# EAGLE design l-band-frontend (EAGLE 9.1.3)
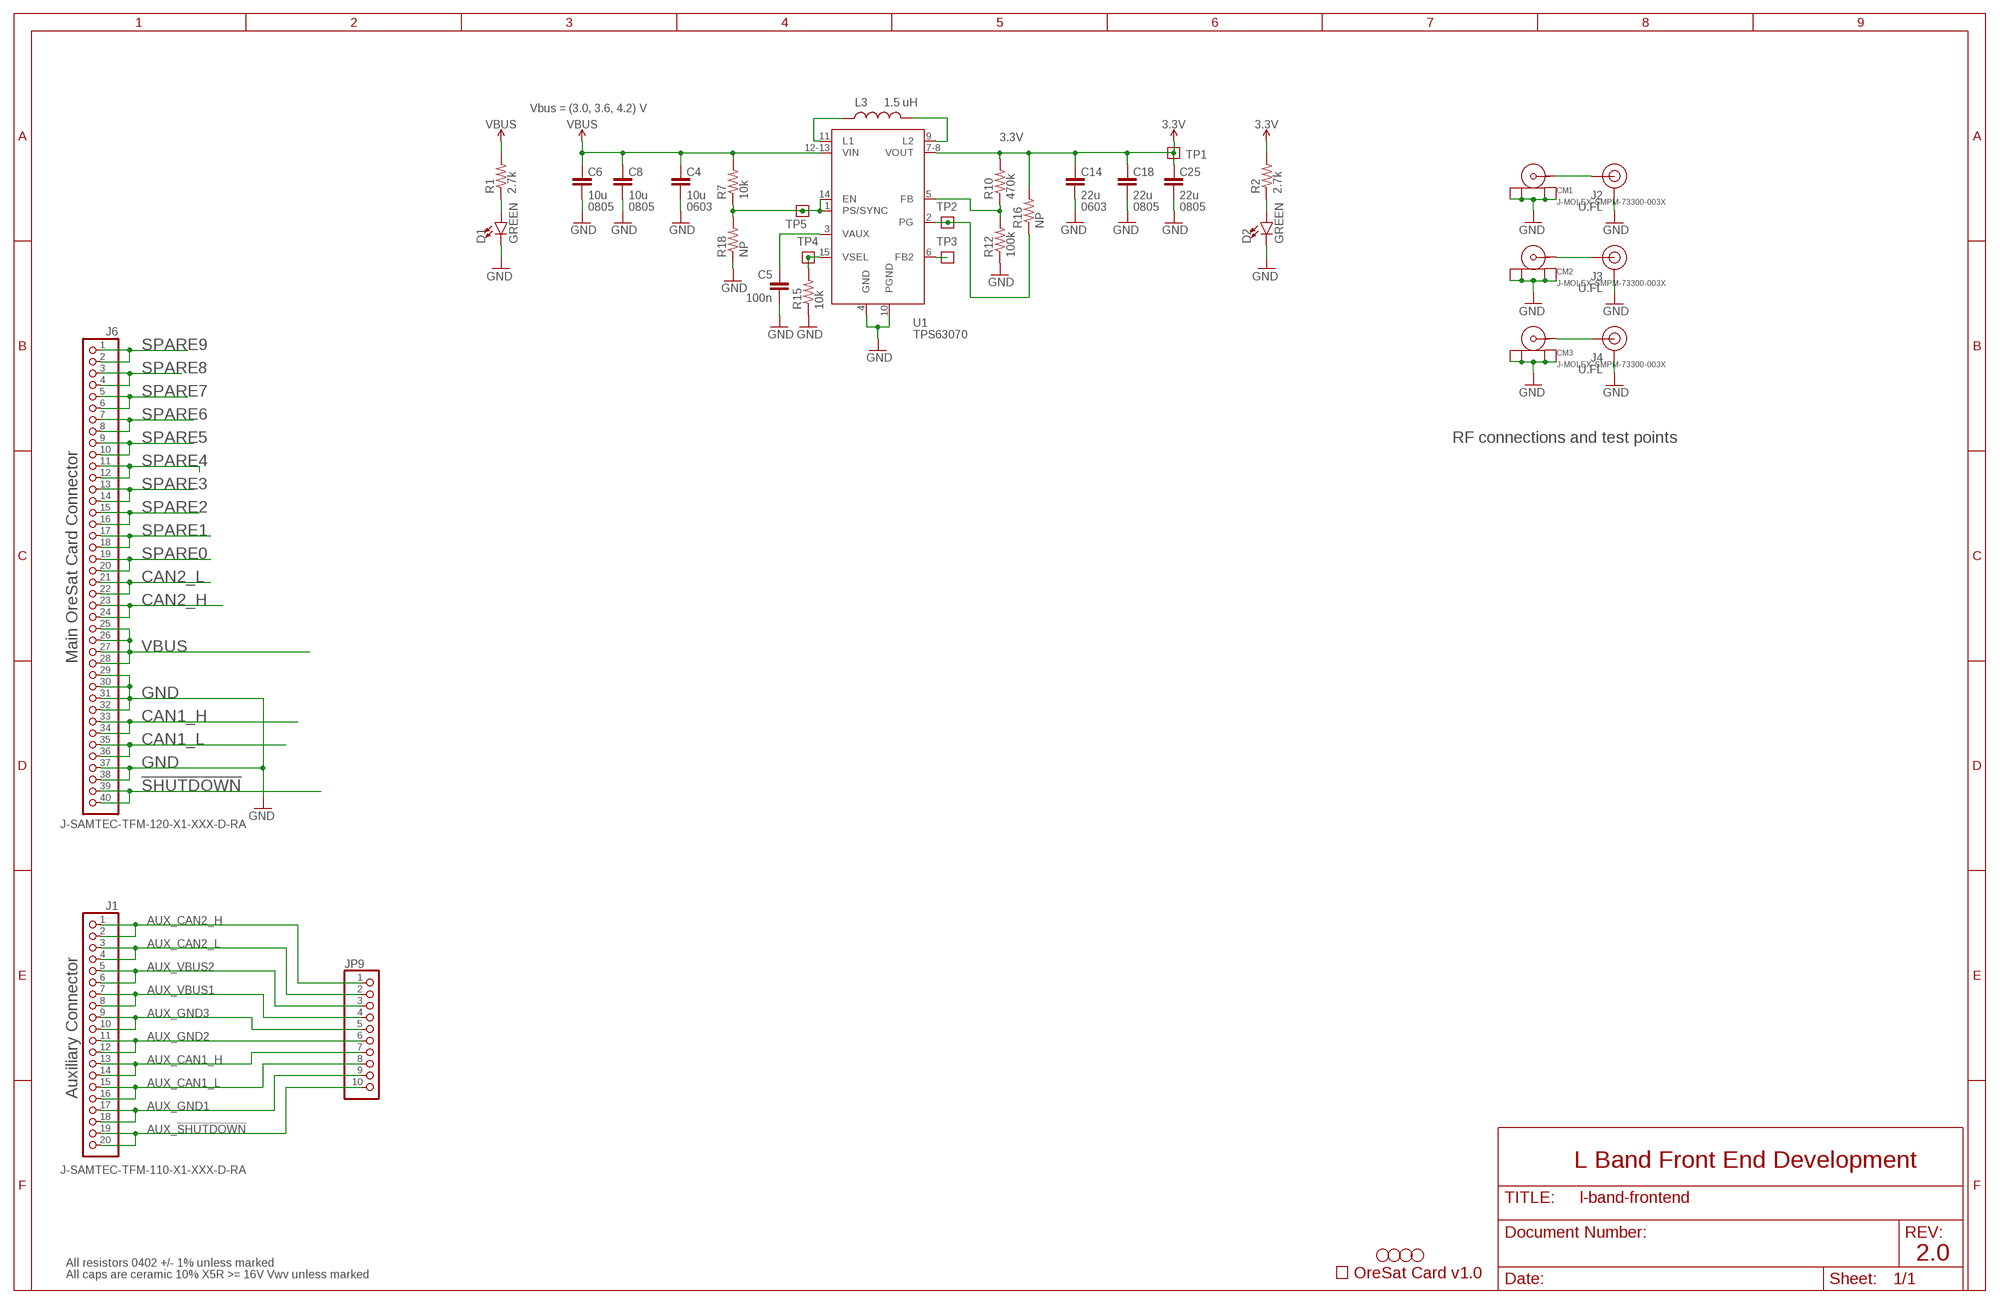
[diagram p0: schematic, sheet 1]

## Parts
C4  10u  C-EU0603-B-NOSILK  [.0603-B-NOSILK]
C5  100n  C-EU0402-B-NOSILK  [.0402-B-NOSILK]
C6  10u  C-EU0805-B-NOSILK  [.0805-B-NOSILK]
C8  10u  C-EU0805-B-NOSILK  [.0805-B-NOSILK]
C14  22u  C-EU0603-B-NOSILK  [.0603-B-NOSILK]
C18  22u  C-EU0805-B-NOSILK  [.0805-B-NOSILK]
C25  22u  C-EU0805-B-NOSILK  [.0805-B-NOSILK]
CARD  ORESAT-CARD-V0.5  [ORESAT-CARD-V1.0]
CM1  J-MOLEX-SMPM-73300-003X  [J-MOLEX-SMPM-073300-003X]
CM2  J-MOLEX-SMPM-73300-003X  [J-MOLEX-SMPM-073300-003X]
CM3  J-MOLEX-SMPM-73300-003X  [J-MOLEX-SMPM-073300-003X]
D1  GREEN  LED-GREEN0603  [LED-0603]
D2  GREEN  LED-GREEN0603  [LED-0603]
H1  STAND-OFFTIGHT  [STAND-OFF-TIGHT]
H2  STAND-OFFTIGHT  [STAND-OFF-TIGHT]
H3  STAND-OFFTIGHT  [STAND-OFF-TIGHT]
H4  STAND-OFFTIGHT  [STAND-OFF-TIGHT]
J1  J-SAMTEC-TFM-110-X1-XXX-D-RA  [J-SAMTEC-TFM-110-X1-XXX-D-RA]
J2  U.FL  U.FL2PIN  [U.FL]
J3  U.FL  U.FL2PIN  [U.FL]
J4  U.FL  U.FL2PIN  [U.FL]
J6  J-SAMTEC-TFM-120-X1-XXX-D-RA  [J-SAMTEC-TFM-120-X1-XXX-D-RA]
JP9  PINHD-1X10  [1X10]
L3  1.5 uH  L-COILCRAFT-XFL4020  [L-COILCRAFT-XFL4020]
R1  2.7k  R-US_0402-B-NOSILK  [.0402-B-NOSILK]
R2  2.7k  R-US_0402-B-NOSILK  [.0402-B-NOSILK]
R7  10k  R-US_0402-B-NOSILK  [.0402-B-NOSILK]
R10  470k  R-US_0402-B-NOSILK  [.0402-B-NOSILK]
R12  100k  R-US_0402-B-NOSILK  [.0402-B-NOSILK]
R15  10k  R-US_0402-B-NOSILK  [.0402-B-NOSILK]
R16  NP  R-US_0402-B-NOSILK  [.0402-B-NOSILK]
R18  NP  R-US_0402-B-NOSILK  [.0402-B-NOSILK]
TP1  TEST-POINT  [2MM-TEST-POINT]
TP2  TEST-POINT  [2MM-TEST-POINT]
TP3  TEST-POINT  [2MM-TEST-POINT]
TP4  TEST-POINT  [2MM-TEST-POINT]
TP5  TEST-POINT  [2MM-TEST-POINT]
U1  TPS63070  TPS63070X  [TPS63070X]

## Nets
3.3V: C14.1 C18.1 C25.1 R2.2 R10.2 R16.2 TP1.1 U1.7-8(VOUT)
!SHUTDOWN: J6.39 J6.40
AUX_!SHUTDOWN: J1.19 J1.20 JP9.10
AUX_CAN1_H: J1.13 J1.14 JP9.7
AUX_CAN1_L: J1.15 J1.16 JP9.8
AUX_CAN2_H: J1.1 J1.2 JP9.1
AUX_CAN2_L: J1.3 J1.4 JP9.2
AUX_GND1: J1.17 J1.18 JP9.9
AUX_GND2: J1.11 J1.12 JP9.6
AUX_GND3: J1.9 J1.10 JP9.5
AUX_VBUS1: J1.7 J1.8 JP9.4
AUX_VBUS2: J1.5 J1.6 JP9.3
CAN1_H: J6.33 J6.34
CAN1_L: J6.35 J6.36
CAN2_H: J6.23 J6.24
CAN2_L: J6.21 J6.22
GND: C4.2 C5.2 C6.2 C8.2 C14.2 C18.2 C25.2 CM1.P$1(SHIELD3) CM1.P$2(SHIELD2) CM1.P$3(SHIELD1) CM1.P$4(SHIELD) CM2.P$1(SHIELD3) CM2.P$2(SHIELD2) CM2.P$3(SHIELD1) CM2.P$4(SHIELD) CM3.P$1(SHIELD3) CM3.P$2(SHIELD2) CM3.P$3(SHIELD1) CM3.P$4(SHIELD) D1.C D2.C J2.1(GND) J2.2(GND) J3.1(GND) J3.2(GND) J4.1(GND) J4.2(GND) J6.29 J6.30 J6.31 J6.32 J6.37 J6.38 R12.1 R15.1 R18.1 U1.4(GND) U1.10(PGND)
N$270: D1.A R1.1
N$271: D2.A R2.1
N$300: CM3.RF(CENTER) J4.FEED(SIGNAL)
RF1: CM1.RF(CENTER) J2.FEED(SIGNAL)
RF2: CM2.RF(CENTER) J3.FEED(SIGNAL)
SPARE0: J6.19 J6.20
SPARE1: J6.17 J6.18
SPARE2: J6.15 J6.16
SPARE3: J6.13 J6.14
SPARE4: J6.11 J6.12
SPARE5: J6.9 J6.10
SPARE6: J6.7 J6.8
SPARE7: J6.5 J6.6
SPARE8: J6.3 J6.4
SPARE9: J6.1 J6.2
TPS-EN1: R7.1 R18.2 TP5.1 U1.1(PS/SYNC) U1.14(EN)
TPS-FB1: R10.1 R12.2 U1.5(FB)
TPS-FB3: TP3.1 U1.6(FB2)
TPS-L3: L3.1 U1.11(L1)
TPS-L4: L3.2 U1.9(L2)
TPS-PG1: R16.1 TP2.1 U1.2(PG)
TPS-VAUX1: C5.1 U1.3(VAUX)
TPS-VSEL1: R15.2 TP4.1 U1.15(VSEL)
VBUS: C4.1 C6.1 C8.1 J6.25 J6.26 J6.27 J6.28 R1.2 R7.2 U1.12-13(VIN)

## Notes on the sheet
- Vbus = (3.0, 3.6, 4.2) V
- 0805 | 0805 | 0603 | 0603 | 0805 | 0805
- RF connections and test points
- Main OreSat Card Connector
- Auxiliary Connector
- L Band Front End Development
- 2.0
- All resistors 0402 +/- 1% unless marked
- All caps are ceramic 10% X5R >= 16V Vwv unless marked

## Library data of the parts
C4 C14 = oresat-rcl:C-EU: CAPACITOR, European symbol; DIS: Digi-Key; DPN: 1276-1001-1-ND; MFR: Samsung; MPN: CL05B104KO5NNNC
C5 = rcl_custom:C-EU: CAPACITOR, European symbol; DIS: Digi-Key; DPN: 1276-1001-1-ND; MFR: Samsung; MPN: CL05B104KO5NNNC
C6 C8 C18 C25 = oresat-rcl:C-EU: CAPACITOR, European symbol
CARD = oresat-card:ORESAT-CARD-V0.5
CM1-CM3 = J-Molex-SMPM-73300-003X:J-MOLEX-SMPM-73300-003X
D1 D2 = SparkFun-LED:LED-GREEN: Green SMD LED Used in manufacturing of various products at SparkFun Packages: 0603 - SMD 0603 package [Product Link] <http://www.futureelectronics.com/en/technologies/semiconductors/optoelectronics/leds/Pages/9894312-LTST-C190GKT.aspx?CrossPart=HSMG-C190&IM=0> LilyPad 1206 - SMD1206 LilyPad package [Product Link] <http://www.futureelectronics.com/en/Technologies/Product.aspx?ProductID=IN150NGHARVATEKCORPORATION2049943&IM=0> 1206 - SMD1206 package [Product Link] <http://www.futureelectronics.com/en/technologies/semiconductors/optoelectronics/leds/Pages/8315665-LTST-C150KGKT.aspx?IM=0> 1206 Bottom Mount -SMD 1206 Bottom Mount [Product Link] <http://www.digikey.com/product-detail/en/lite-on-inc/LTST-C230KGKT/160-1456-1-ND/386854> SparkFun Products: Pro Mini 328 -5V <https://www.sparkfun.com/products/821> RedBoard <https://www.sparkfun.com/products/12757> MP3 Trigger <https://www.sparkfun.com/products/13720> Makey Makey <https://www.sparkfun.com/products/11076>; PROD_ID: DIO-00821
H1-H4 = SparkFun-Hardware:STAND-OFF: Stand Off Drill holes for mechanically mounting via screws, standoffs, etc. Note: Use the keepout ring to avoid running the screw head into surrounding components. Variant Overviews STAND-OFF - Mechanical footprint for a #4 phillips button head screw. STAND-OFF-TIGHT - Mechanical footprint for a #4 phillips button head screw, Example SparkFun Products Screw - Phillips Head (1/4", 4-40, 10 pack) <https://www.sparkfun.com/products/10453> (PRT-10453) Screw - Phillips Head (1/2", 4-40, 10 pack) <https://www.sparkfun.com/products/10452> (PRT-10452) Screw - Phillips Head (3/4", 4-40, 10 pack) <https://www.sparkfun.com/products/10451> (PRT-10451) Screw - Phillips Head (1", 4-40, 10 pack) <https://www.sparkfun.com/products/10450> (PRT-10450)
J1 = J-Samtec-TFM-110-X1-XXX-D-RA:J-SAMTEC-TFM-110-X1-XXX-D-RA; DIS: Digi-Key; DPN: SAM10113-ND; MFR: Samtec; MPN: TFM-110-01-L-D-RA
J2-J4 = SparkFun-Connectors:U.FL2PIN: SMD Antenna Connector - U.FL 2mm height, 3.0mm x 3.0mm receptacle size. SparkFun Products: SparkFun WiFi Shield - ESP8266 <https://www.sparkfun.com/products/13287> SparkFun ESP8266 Thing <https://www.sparkfun.com/products/13231> SparkFun MiniGen - Pro Mini Signal Generator Shield <https://www.sparkfun.com/products/11420>; PROD_ID: CONN-09193; SF_ID: WRL-09144
J6 = J-Samtec-TFM-120-X1-XXX-D-RA:J-SAMTEC-TFM-120-X1-XXX-D-RA; DIS: Digi-Key; DPN: SAM10145-ND; MFR: Samtec; MPN: TFM-120-01-L-D-RA
JP9 = pinhead:PINHD-1X10: PIN HEADER
L3 = L-Coilcraft-XFL4020:L-COILCRAFT-XFL4020; DIS: Mouser; DPN: 994-XFL4020-152MEB; MFR: Coilcraft; MPN: XFL4020-152ME
R1 R2 R7 R10 R12 R15 R16 R18 = rcl_custom:R-US_: RESISTOR, American symbol; DIS: Digi-Key; DPN: 1276-4275-1-ND; MFR: Samsung; MPN: RC1005F6653CS
TP1-TP5 = Tova:TEST-POINT
U1 = ic-pwr-tps63070x:TPS63070X: TPS63070 2-V to 16-V Buck-Boost Converter With 3.6-A Switch Current; DIS: Digi-Key; DPN: 296-44874-1-ND; MFR: TI; MPN: TPS63070

## Board
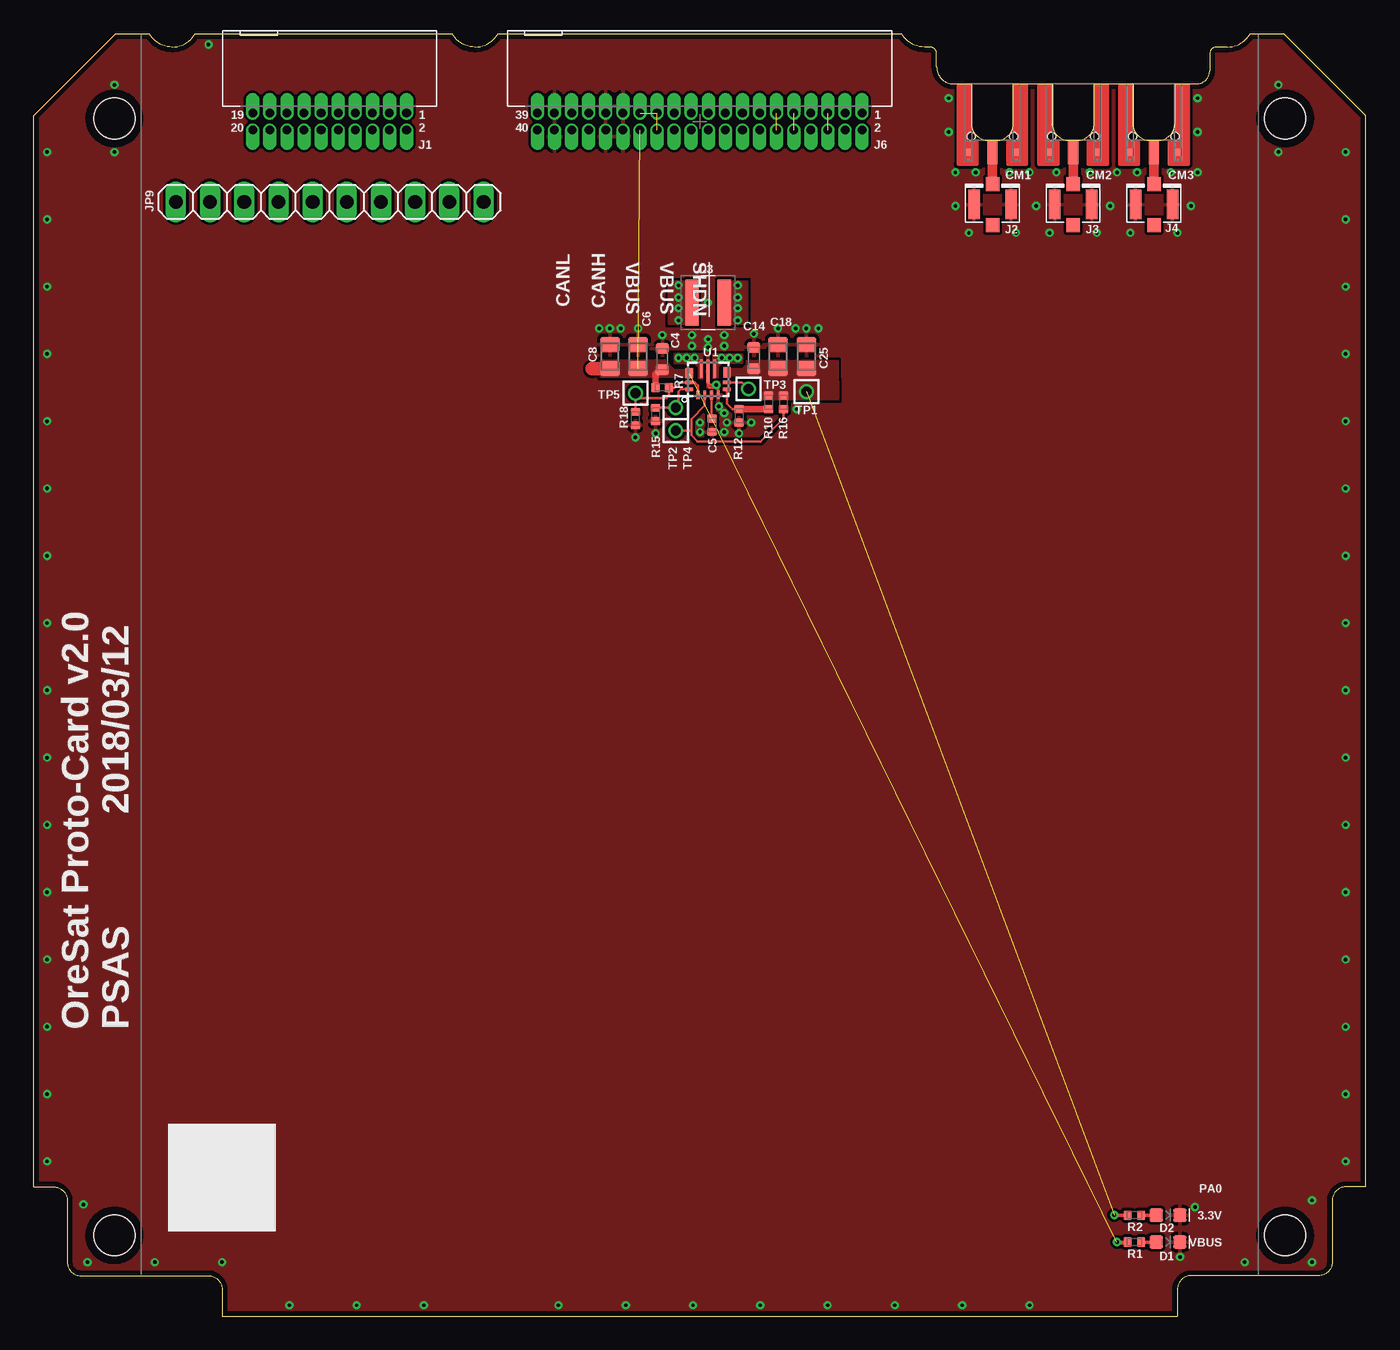
[diagram p1: board, top side]
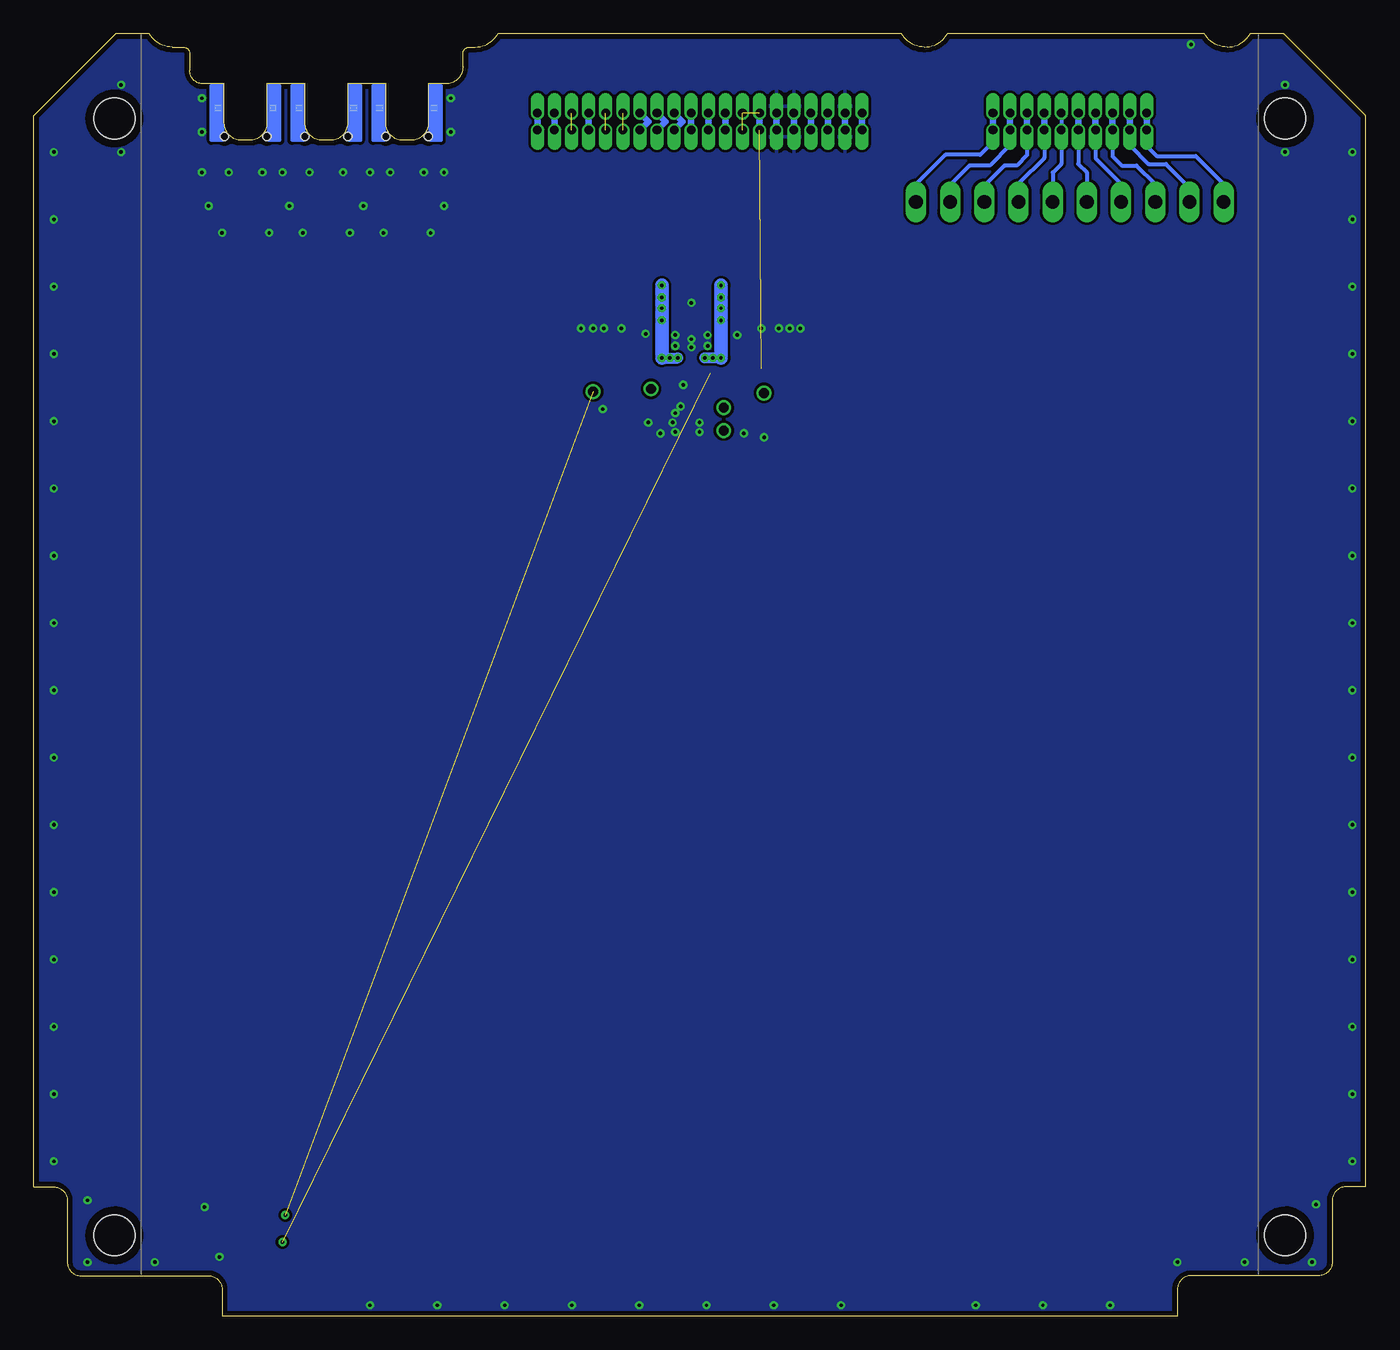
[diagram p2: board, bottom side, seen from below]

Size 99 x 95.3 mm. Coordinates in mm from the lower left corner, seen from the top.
Outline: 66.2,94.3 66.61,94.3 arc-90 67.11,93.8 67.11,92.83 arc90 68.38,91.56 69.25,91.56
Outline: 88.7,94.3 87.89,94.3 arc90 87.39,93.8 87.39,92.56 arc-90 86.4,91.56 85.25,91.56
Outline: 73.25,91.56 75.25,91.56
Outline: 79.25,91.56 81.25,91.56
Copper layers (1*16): Top 0.0356mm / dielectric 1.5011mm / Bottom 0.0356mm
Design rules "OSH-Park-2-layer *": minimum track width 6mil, minimum drill 10mil, track to track 6mil, track to pad 6mil, pad to pad 6mil, via to via 6mil, smd to smd 6mil, copper to edge 15mil, drill to drill 6mil, minimum pad ring 7mil, minimum via ring 7mil, stop-mask expansion 3mil, vias tented up to drill 13mil, thermal gap 10mil

### Footprints (pad centres in the part's own frame; a part is rotated, then mirrored left to right if it is on the bottom)
.0603-B-NOSILK = smd 0.8 x 0.95: 1 -0.8,0; 2 0.8,0
.0402-B-NOSILK = smd 0.6 x 0.7: 1 -0.5,0; 2 0.5,0
.0805-B-NOSILK = smd 1.15 x 1.45: 1 -0.9,0; 2 0.9,0
J-MOLEX-SMPM-073300-003X = smd 0.508 x 0.508: P$1 -1.778,-5.08; P$2 1.778,-5.08 | smd 0.508 x 0.508 bottom: P$3 -2.032,-1.778; P$4 2.032,-1.778 | smd 0.762 x 1.778: RF 0,-5.08 | hole 0.61: 1.587,-3.886; -1.587,-3.886
LED-0603 = smd 1 x 1: A -0.877,0; C 0.877,0
STAND-OFF-TIGHT = hole 3.048: 0,0
J-SAMTEC-TFM-110-X1-XXX-D-RA = drill 0.635 pad 0.965 offset: 1 5.715,0.635; 2 5.715,-0.635; 3 4.445,0.635; 4 4.445,-0.635; 5 3.175,0.635; 6 3.175,-0.635; 7 1.905,0.635; 8 1.905,-0.635; 9 0.635,0.635; 10 0.635,-0.635; 11 -0.635,0.635; 12 -0.635,-0.635; 13 -1.905,0.635; 14 -1.905,-0.635; 15 -3.175,0.635; 16 -3.175,-0.635; 17 -4.445,0.635; 18 -4.445,-0.635; 19 -5.715,0.635; 20 -5.715,-0.635
U.FL = smd 2.2 x 0.85: 1 0,1.375; 2 0,-1.375 | smd 1.05 x 1: FEED 1.525,0; NC -1.525,0
J-SAMTEC-TFM-120-X1-XXX-D-RA = drill 0.635 pad 0.965 offset: 1 12.065,0.635; 2 12.065,-0.635; 3 10.795,0.635; 4 10.795,-0.635; 5 9.525,0.635; 6 9.525,-0.635; 7 8.255,0.635; 8 8.255,-0.635; 9 6.985,0.635; 10 6.985,-0.635; 11 5.715,0.635; 12 5.715,-0.635; 13 4.445,0.635; 14 4.445,-0.635; 15 3.175,0.635; 16 3.175,-0.635; 17 1.905,0.635; 18 1.905,-0.635; 19 0.635,0.635; 20 0.635,-0.635; 21 -0.635,0.635; 22 -0.635,-0.635; 23 -1.905,0.635; 24 -1.905,-0.635; 25 -3.175,0.635; 26 -3.175,-0.635; 27 -4.445,0.635; 28 -4.445,-0.635; 29 -5.715,0.635; 30 -5.715,-0.635; 31 -6.985,0.635; 32 -6.985,-0.635; 33 -8.255,0.635; 34 -8.255,-0.635; 35 -9.525,0.635; 36 -9.525,-0.635; 37 -10.795,0.635; 38 -10.795,-0.635; 39 -12.065,0.635; 40 -12.065,-0.635
1X10 = drill 1.016 long: 1 -11.43,0; 2 -8.89,0; 3 -6.35,0; 4 -3.81,0; 5 -1.27,0; 6 1.27,0; 7 3.81,0; 8 6.35,0; 9 8.89,0; 10 11.43,0
L-COILCRAFT-XFL4020 = smd 0.98 x 3.4: 1 -1.2,0; 2 1.2,0
2MM-TEST-POINT = drill 0.737: 1 0,0
TPS63070X = smd 0.6 x 0.25: 1 -1.15,0.75; 2 -1.15,0.25; 3 -1.15,-0.25; 4 -1.15,-0.75 | smd 0.25 x 0.6: 5 -0.725,-1.4; 6 -0.225,-1.4; 14 -0.225,1.4; 15 -0.725,1.4 | smd 0.75 x 0.6: 7-8 0.525,-1.4; 12-13 0.475,1.4 | smd 1.35 x 0.25: 9 0.775,-0.5; 11 0.775,0.5 | smd 1.7 x 0.25: 10 0.6,0

### Placement (x,y rotation side)
C4  46.72,71.1 90 top
C5  50.42,66.2 270 top
C6  44.92,71.3 90 top
C8  42.82,71.3 90 top
C14  53.52,71.2 90 top
C18  55.32,71.3 90 top
C25  57.42,71.3 90 top
CARD  0,0 0 top
CM1  71.25,91.56 0 top
CM2  77.25,91.56 0 top
CM3  83.25,91.56 0 top
D1  84.3,5.5 0 top
D2  84.3,7.5 0 top
H1  93,6 0 top
H2  93,89 0 top
H3  6,89 0 top
H4  6,6 0 top
J1  22,88.77 0 top
J2  71.25,82.6 90 top
J3  77.25,82.6 90 top
J4  83.25,82.6 90 top
J6  49.5,88.77 0 top
JP9  22,82.8 180 top
L3  50.12,75.3 0 top
R1  81.8,5.5 180 top
R2  81.8,7.5 180 top
R7  46.72,69 180 top
R10  54.62,67.9 90 top
R12  52.42,66.9 90 top
R15  46.22,67 90 top
R16  55.72,67.9 90 top
R18  44.72,66.7 90 top
TP1  57.42,68.7 90 top
TP2  47.72,65.8 90 top
TP3  53.12,68.9 90 top
TP4  47.72,67.5 90 top
TP5  44.72,68.6 90 top
U1  50.12,69.6 90 top

### Tracks (layer width: path | path; a pad name or v marks a point on that pad's centre or on a via)
3.3V  (via drill 0.25)  (1 unrouted)
  Top 0.25: v80.3,7.5 R2.2
  pour Top (rank 2, no thermals): 51.32,70.4 52.72,70.4 53.02,70.7 53.02,71 59.72,71 59.76,68.1 54.12,68.1 54.12,69.9 51.32,69.9
!SHUTDOWN
  Bottom 0.5: J6.39 J6.40
AUX_!SHUTDOWN
  Bottom 0.3: J1.20 16.29,86.94 15.55,86.2 12.65,86.2 10.55,84.1 10.57,84.08 JP9.10
  Bottom 0.5: J1.20 J1.19
AUX_CAN1_H
  Bottom 0.3: J1.14 20.09,86.05 18.19,84.14 JP9.7
  Bottom 0.5: J1.14 J1.13
AUX_CAN1_L
  Bottom 0.3: J1.16 18.82,86.17 18.15,85.5 17.05,85.5 15.65,84.1 JP9.8
  Bottom 0.5: J1.16 J1.15
AUX_CAN2_H
  Bottom 0.3: J1.2 27.71,87.23 28.65,86.3 31.25,86.3 33.45,84.1 33.45,83.32 JP9.1
  Bottom 0.5: J1.2 J1.1
AUX_CAN2_L
  Bottom 0.3: J1.4 26.45,87 27.95,85.5 29.45,85.5 30.95,84 30.89,83.94 JP9.2
  Bottom 0.5: J1.4 J1.3
AUX_GND1
  Bottom 0.3: J1.18 17.55,87 16.15,85.6 14.85,85.6 13.11,83.86 JP9.9
  Bottom 0.5: J1.18 J1.17
AUX_GND2
  Bottom 0.3: J1.12 21.36,85.61 20.75,85 20.75,83.32 JP9.6
  Bottom 0.5: J1.12 J1.11
AUX_GND3
  Bottom 0.3: JP9.5 23.27,84.98 22.64,85.61 J1.10 J1.9
AUX_VBUS1
  Bottom 0.3: J1.8 23.91,86.05 25.81,84.14 JP9.4
  Bottom 0.5: J1.8 J1.7
AUX_VBUS2
  Bottom 0.3: J1.6 25.18,86.28 25.95,85.5 26.85,85.5 28.35,84 JP9.3
  Bottom 0.5: J1.6 J1.5
CAN1_H
  Bottom 0.5: J6.33 J6.34
CAN1_L
  Bottom 0.5: J6.35 J6.36
CAN2_H
  Top 0.2: J6.24
  Bottom 0.5: J6.23 J6.24
CAN2_L
  Top 0.2: 48.9,88.1 J6.22
  Bottom 0.5: J6.21 J6.22
GND  (via drill 0.25)
  Top 0.2: U1.10 50.12,69.1 | 50.12,69.1 50.22,69.2 v50.72,69.2 50.87,69.05 U1.4 | 50.82,69 50.59,69 50.22,69 50.12,69.1
  Bottom 0.5: J6.37 J6.38 | J6.31 J6.32 | J6.29 J6.30
  other vias: 4,4 97.5,11.5 85.2,4.4 86.3,8.1 1,11.5 1,16.5 1,21.5 1,26.5 1,31.5 1,36.5 1,41.5 1,46.5 1,51.5 1,56.5 1,61.5 1,66.5 1,71.5 1,76.5 1,81.5 1,86.5 6,86.5 6,91.5 97.5,16.5 97.5,21.5 97.5,26.5 97.5,31.5 97.5,36.5 97.5,41.5 97.5,46.5 97.5,51.5 97.5,56.5 97.5,61.5 97.5,66.5 97.5,71.5 97.5,76.5 97.5,81.5 97.5,86.5 92.5,86.5 92.5,91.5 95,8.6 95,4 90,4 3.7,8.3 9,4 13,94.5 50.92,67.6 51.32,67.1 55.32,73.4 57.42,73.4 56.62,73.4 58.32,73.4 53.52,73 51.32,72.1 51.32,72.9 48.92,72.9 48.92,72.1 50.12,72 50.12,72.6 50.12,75.3 51.32,65.7 51.52,66.4 53.32,66.4 52.42,65.6 46.72,72.9 44.92,73.4 42.82,73.4 43.62,73.4 42.02,73.4 49.52,65.7 49.52,66.4 46.22,65.6 44.72,65.3 56.7,67.4 14,4 19,0.8 24,0.8 29,0.8 39,0.8 44,0.8 49,0.8 54,0.8 59,0.8 64,0.8 69,0.8 74,0.8 86.5,90.5 86.5,88 86.5,85 84.5,85 82,85 80.5,85 78.5,85 76,85 74,85 72.5,85 70,85 68.5,85 68,88 68,90.5 73,80.5 69.5,80.5 75.5,80.5 79,80.5 81.5,80.5 85,80.5 86,82.5 80,82.5 74.5,82.5 68.5,82.5
  pour Top (isolate 0.2, rank 6): 0,0 99,0 99,95.3 0,95.3
  pour Bottom (isolate 0.2, rank 6): 0,0 99,0 99,95.3 0,95.3
N$270
  Top 0.25: R1.1 D1.A
N$271
  Top 0.25: R2.1 D2.A
N$300
  Top 0.7: CM3.RF J4.FEED
RF1
  Top 0.7: CM1.RF J2.FEED
RF2
  Top 0.7: CM2.RF J3.FEED
SPARE0
  Bottom 0.5: J6.19 J6.20
SPARE1
  Bottom 0.5: J6.17 50.77,88.77 J6.18
SPARE2
  Bottom 0.5: J6.15 52.04,88.77 J6.16
SPARE3
  Bottom 0.5: J6.14 53.31,88.77 J6.13 | J6.14 53.74,88.2 53.8,88.2 53.8,88.36 J6.14
SPARE4  (1 unrouted)
SPARE5  (1 unrouted)
SPARE6
  Bottom 0.5: J6.7 J6.8
SPARE7  (1 unrouted)
SPARE8
  Bottom 0.5: J6.3 J6.4
SPARE9
  Bottom 0.5: J6.1 J6.2
TPS-EN1
  Top 0.2: U1.1 49.37,69.15 49.15,69.38 U1.14 47.99,69.38 47.62,69 R7.1 47.22,68.4 47.02,68.2 45.12,68.2 TP5.1 R18.2
TPS-FB1
  Top 0.2: U1.5 51.52,67.8 51.92,67.4 R12.2
  Top 0.5: R12.2 R10.1
TPS-FB3
  Top 0.2: U1.6 52.65,69.38 TP3.1
TPS-L3  (via drill 0.25)
  Bottom 0.8: v47.92,71.2 v49.12,71.2
  Bottom 1: v47.92,71.2 v47.92,76.6
  other vias: 48.52,71.2 47.92,74 47.92,74.9 47.92,75.7
  pour Top (no thermals): 49.72,69.7 49.72,71.5 47.62,71.5 47.62,70.8 49.12,70.8 49.42,70.5 49.42,69.7
  pour Top (no thermals): 49.32,76.9 49.32,73.7 47.22,73.7 47.22,76.9
TPS-L4  (via drill 0.25)
  Bottom 0.8: v52.32,71.2 v51.12,71.2
  Bottom 1: v52.32,71.2 v52.32,74 v52.32,76.6
  other vias: 51.72,71.2 52.32,75.7 52.32,74.9
  pour Top (no thermals): 50.52,69.7 50.52,71.5 52.62,71.5 52.62,70.8 51.12,70.8 50.82,70.5 50.82,69.7
  pour Top (no thermals): 50.92,73.7 50.92,76.9 53.02,76.9 53.02,73.7
TPS-PG1
  Top 0.2: U1.2 49.87,67.65 48.87,66.65 48.87,65.8 | R16.1 55.72,66.7 54.02,65 49.32,65 48.87,65.45 48.87,65.8 | TP2.1 48.87,65.8
TPS-VAUX1
  Top 0.2: U1.3 50.37,67.84 50.36,67.83 50.36,66.76 C5.1
TPS-VSEL1
  Top 0.2: U1.15 48.09,68.88 47.92,68.7 47.92,67.8 TP4.1 R15.2
VBUS  (via drill 0.25)  (4 unrouted)
  Top 0.3: v80.5,5.5 R1.2
  Top 0.5: R7.2 46.22,70 46.52,70.3 C4.1
  Top 1: C8.1 41.5,70.4
  Bottom 0.5: J6.27 J6.28
  pour Top (rank 2, no thermals): 48.92,70.3 47.62,70.3 46.92,71 42.12,71 42.12,69.8 48.92,69.8

### Text on the board
tPlace: VBUS | VBUS | !SHDN | CANL | CANH | 2018/03/12 | OreSat Proto-Card v2.0 | PSAS | PA0 | 3.3V | VBUS